# EAGLE design PMI_board (EAGLE 7.5.0)
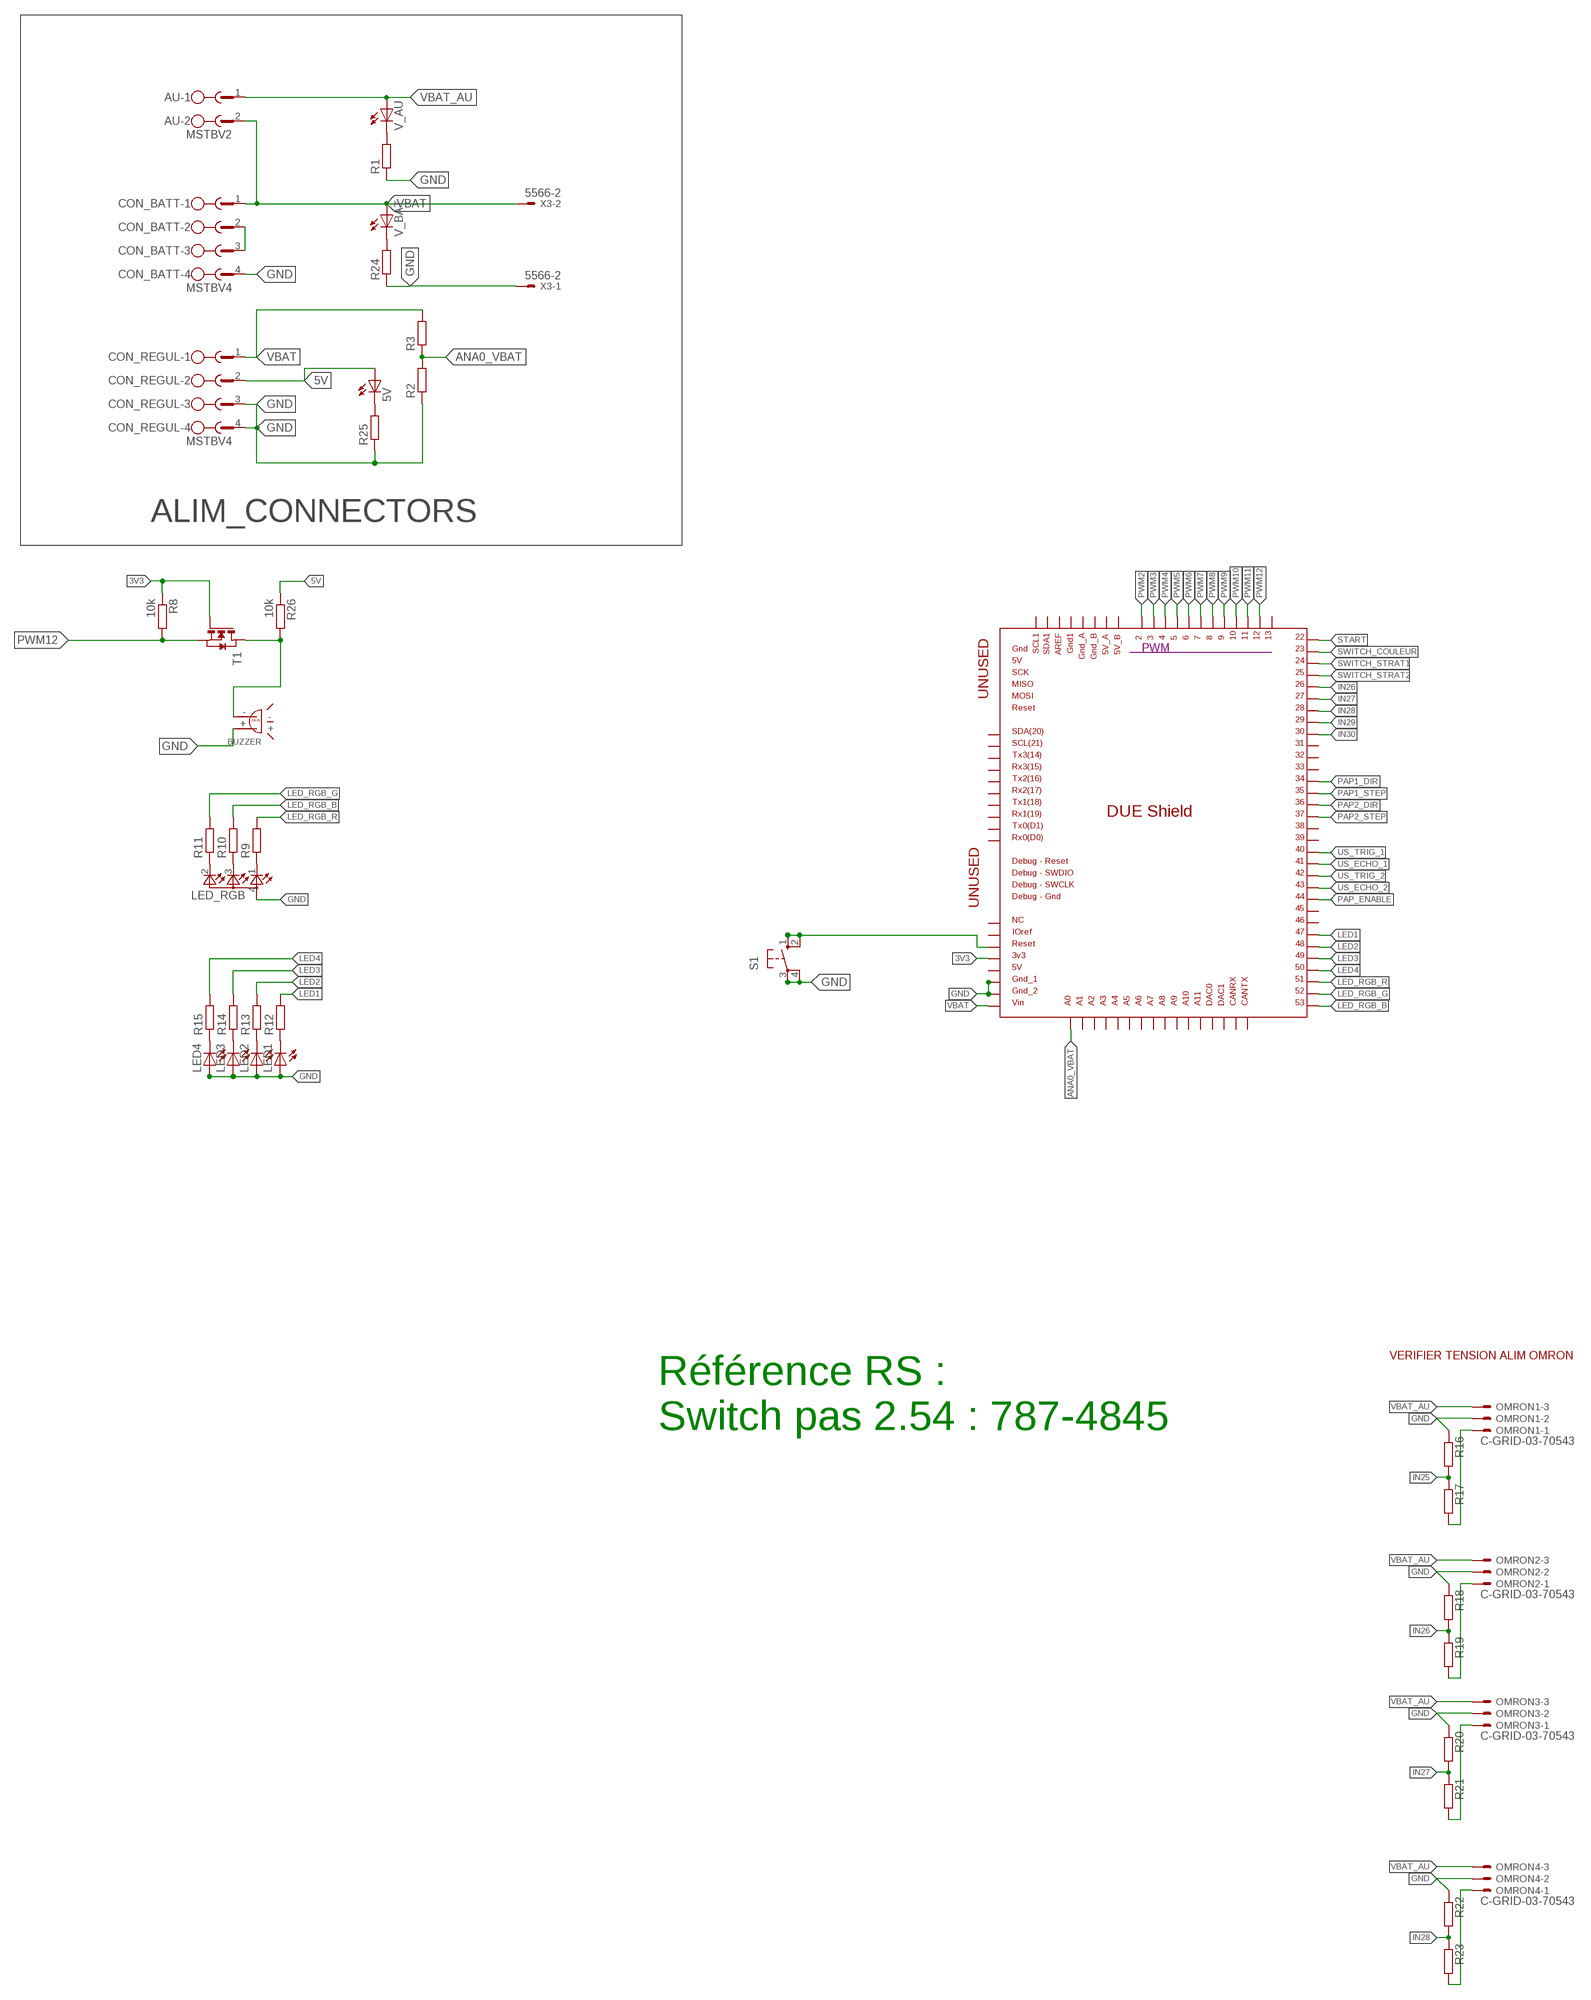
[diagram p0: schematic, sheet 1, part 1 of 2]
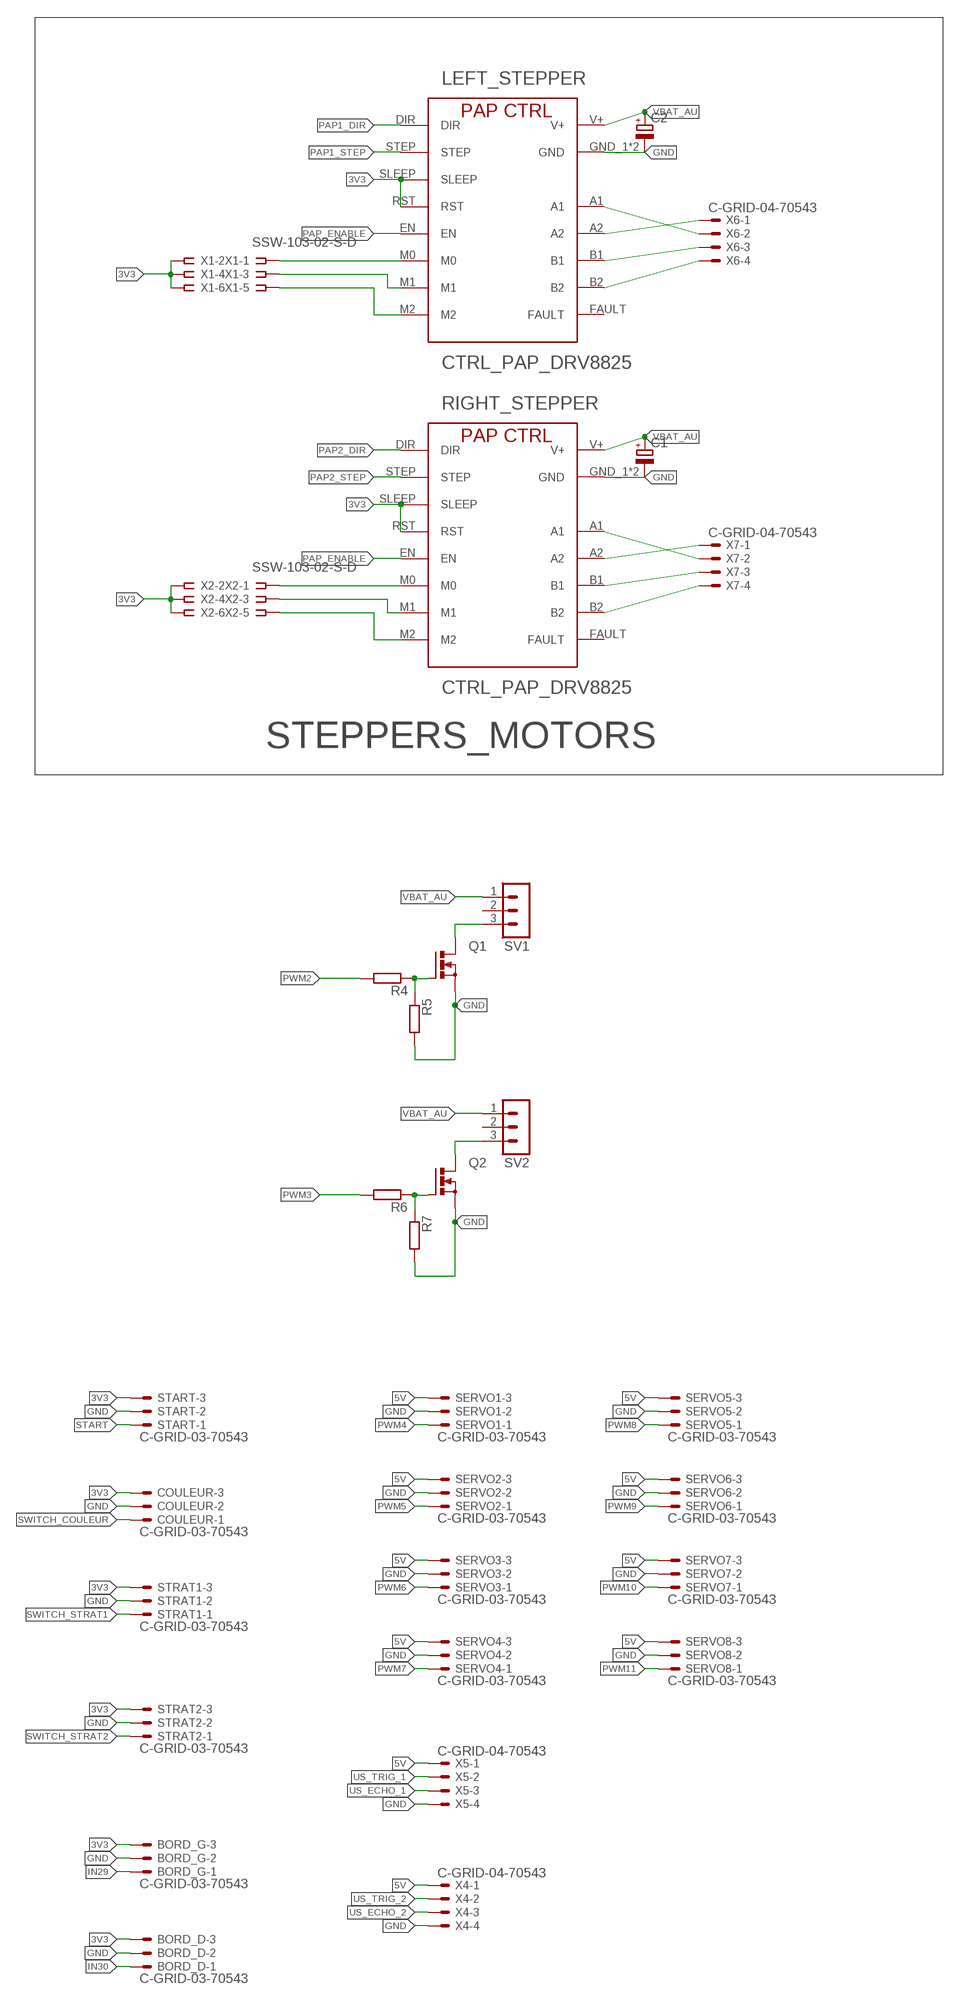
[diagram p1: schematic, sheet 1, part 2 of 2]

## Parts
5V  LED5MM  [LED5MM]
AU  MSTBV2  [MSTBV2]
BORD_D  C-GRID-03-70543  [70543-03]
BORD_G  C-GRID-03-70543  [70543-03]
BUZZER  BUZZER  [BUZZER]
C1  CPOL-EUD  [PANASONIC_D]
C2  CPOL-EUD  [PANASONIC_D]
CON_BATT  MSTBV4  [MSTBV4]
CON_REGUL  MSTBV4  [MSTBV4]
COULEUR  C-GRID-03-70543  [70543-03]
LED1  LED3MM  [LED3MM]
LED2  LED3MM  [LED3MM]
LED3  LED3MM  [LED3MM]
LED4  LED3MM  [LED3MM]
LED_RGB  TOPLED-3QPE_MAPPING  [P-LCC-4-3]
LEFT_STEPPER  CTRL_PAP_DRV8825  [CTRL_PAP]
OMRON1  C-GRID-03-70543  [70543-03]
OMRON2  C-GRID-03-70543  [70543-03]
OMRON3  C-GRID-03-70543  [70543-03]
OMRON4  C-GRID-03-70543  [70543-03]
Q1  PMOSFET_NTO220BV  [TO220BV]
Q2  PMOSFET_NTO220BV  [TO220BV]
R1  R-EU_M1206  [M1206]
R2  R-EU_M1206  [M1206]
R3  R-EU_M1206  [M1206]
R4  R-EU_M1206  [M1206]
R5  R-EU_M1206  [M1206]
R6  R-EU_M1206  [M1206]
R7  R-EU_M1206  [M1206]
R8  10k  R-EU_M1206  [M1206]
R9  R-EU_M1206  [M1206]
R10  R-EU_M1206  [M1206]
R11  R-EU_M1206  [M1206]
R12  R-EU_M1206  [M1206]
R13  R-EU_M1206  [M1206]
R14  R-EU_M1206  [M1206]
R15  R-EU_M1206  [M1206]
R16  R-EU_M1206  [M1206]
R17  R-EU_M1206  [M1206]
R18  R-EU_M1206  [M1206]
R19  R-EU_M1206  [M1206]
R20  R-EU_M1206  [M1206]
R21  R-EU_M1206  [M1206]
R22  R-EU_M1206  [M1206]
R23  R-EU_M1206  [M1206]
R24  R-EU_M1206  [M1206]
R25  R-EU_M1206  [M1206]
R26  10k  R-EU_M1206  [M1206]
RIGHT_STEPPER  CTRL_PAP_DRV8825  [CTRL_PAP]
S1  10-XX  [B3F-10XX]
SERVO1  C-GRID-03-70543  [70543-03]
SERVO2  C-GRID-03-70543  [70543-03]
SERVO3  C-GRID-03-70543  [70543-03]
SERVO4  C-GRID-03-70543  [70543-03]
SERVO5  C-GRID-03-70543  [70543-03]
SERVO6  C-GRID-03-70543  [70543-03]
SERVO7  C-GRID-03-70543  [70543-03]
SERVO8  C-GRID-03-70543  [70543-03]
START  C-GRID-03-70543  [70543-03]
STRAT1  C-GRID-03-70543  [70543-03]
STRAT2  C-GRID-03-70543  [70543-03]
SV1  MA03-1  [MA03-1]
SV2  MA03-1  [MA03-1]
T1  NMOSSOT23  [SOT-23]
U$1  DUE(NORMAL)  [DUE(NORMAL)]
V_AU  LED5MM  [LED5MM]
V_BAT  LED5MM  [LED5MM]
X1  SSW-103-02-S-D  [SSW-103-02-S-D]
X2  SSW-103-02-S-D  [SSW-103-02-S-D]
X3  5566-2  [5566-2]
X4  C-GRID-04-70543  [70543-04]
X5  C-GRID-04-70543  [70543-04]
X6  C-GRID-04-70543  [70543-04]
X7  C-GRID-04-70543  [70543-04]

## Nets
3V3: BORD_D.3 BORD_G.3 COULEUR.3 LEFT_STEPPER.RST LEFT_STEPPER.SLEEP R8.1 RIGHT_STEPPER.RST RIGHT_STEPPER.SLEEP START.3 STRAT1.3 STRAT2.3 T1.3(G) U$1.3V3 X1.2 X1.4 X1.6 X2.2 X2.4 X2.6
5V: 5V.A CON_REGUL.2 R26.1 SERVO1.3 SERVO2.3 SERVO3.3 SERVO4.3 SERVO5.3 SERVO6.3 SERVO7.3 SERVO8.3 X4.1 X5.1
A1: LEFT_STEPPER.A1 X6.2
A2: LEFT_STEPPER.A2 X6.1
ANA0_VBAT: R2.2 R3.1 U$1.A0
B1: LEFT_STEPPER.B1 X6.3
B2: LEFT_STEPPER.B2 X6.4
GND: BORD_D.2 BORD_G.2 BUZZER.+ C1.- C2.- CON_BATT.4 CON_REGUL.3 CON_REGUL.4 COULEUR.2 LED1.A LED2.A LED3.A LED4.A LED_RGB.4(A2) LEFT_STEPPER.GND_1(GND) LEFT_STEPPER.GND_2(GND) OMRON1.2 OMRON2.2 OMRON3.2 OMRON4.2 Q1.S Q2.S R1.1 R2.1 R5.2 R7.2 R16.1 R18.1 R20.1 R22.1 R24.1 R25.1 RIGHT_STEPPER.GND_1(GND) RIGHT_STEPPER.GND_2(GND) S1.3(P) S1.4(P1) SERVO1.2 SERVO2.2 SERVO3.2 SERVO4.2 SERVO5.2 SERVO6.2 SERVO7.2 SERVO8.2 START.2 STRAT1.2 STRAT2.2 U$1.GND_1 U$1.GND_2 X3.1 X4.4 X5.4
IN25: R16.2 R17.1
IN26: R18.2 R19.1 U$1.26
IN27: R20.2 R21.1 U$1.27
IN28: R22.2 R23.1 U$1.28
IN29: BORD_G.1 U$1.29
IN30: BORD_D.1 U$1.30
LED1: R12.2 U$1.47
LED2: R13.2 U$1.48
LED3: R14.2 U$1.49
LED4: R15.2 U$1.50
LED_RGB_B: R10.2 U$1.53
LED_RGB_G: R11.2 U$1.52
LED_RGB_R: R9.2 U$1.51
N$1: CON_BATT.2 CON_BATT.3
N$2: R1.2 V_AU.K(C)
N$3: LEFT_STEPPER.M0 X1.1
N$4: LEFT_STEPPER.M1 X1.3
N$5: LEFT_STEPPER.M2 X1.5
N$6: RIGHT_STEPPER.M0 X2.1
N$7: RIGHT_STEPPER.M1 X2.3
N$8: RIGHT_STEPPER.M2 X2.5
N$9: S1.1(S) S1.2(S1) U$1.RESET
N$10: Q1.G R4.1 R5.1
N$18: Q1.D SV1.3
N$19: Q2.G R6.1 R7.1
N$20: Q2.D SV2.3
N$21: BUZZER.- R26.2 T1.1(D)
N$22: OMRON1.1 R17.2
N$23: OMRON2.1 R19.2
N$24: OMRON3.1 R21.2
N$25: OMRON4.1 R23.2
N$26: RIGHT_STEPPER.A1 X7.2
N$27: RIGHT_STEPPER.A2 X7.1
N$28: RIGHT_STEPPER.B1 X7.3
N$29: RIGHT_STEPPER.B2 X7.4
N$31: LED_RGB.1(CRED) R9.1
N$32: LED_RGB.3(CBLUE) R10.1
N$33: LED_RGB.2(CGREEN) R11.1
N$34: LED1.K(C) R12.1
N$35: LED2.K(C) R13.1
N$36: LED3.K(C) R14.1
N$37: LED4.K(C) R15.1
N$44: R24.2 V_BAT.K(C)
N$45: 5V.K(C) R25.2
PAP1_DIR: LEFT_STEPPER.DIR U$1.34
PAP1_STEP: LEFT_STEPPER.STEP U$1.35
PAP2_DIR: RIGHT_STEPPER.DIR U$1.36
PAP2_STEP: RIGHT_STEPPER.STEP U$1.37
PAP_ENABLE: LEFT_STEPPER.EN RIGHT_STEPPER.EN U$1.44
PWM2: R4.2 U$1.2
PWM3: R6.2 U$1.3
PWM4: SERVO1.1 U$1.4
PWM5: SERVO2.1 U$1.5
PWM6: SERVO3.1 U$1.6
PWM7: SERVO4.1 U$1.7
PWM8: SERVO5.1 U$1.8
PWM9: SERVO6.1 U$1.9
PWM10: SERVO7.1 U$1.10
PWM11: SERVO8.1 U$1.11
PWM12: R8.2 T1.2(S) U$1.12
START: START.1 U$1.22
SWITCH_COULEUR: COULEUR.1 U$1.23
SWITCH_STRAT1: STRAT1.1 U$1.24
SWITCH_STRAT2: STRAT2.1 U$1.25
US_ECHO_1: U$1.41 X5.3
US_ECHO_2: U$1.43 X4.3
US_TRIG_1: U$1.40 X5.2
US_TRIG_2: U$1.42 X4.2
VBAT: AU.2 CON_BATT.1 CON_REGUL.1 R3.2 U$1.VIN V_BAT.A X3.2
VBAT_AU: AU.1 C1.+ C2.+ LEFT_STEPPER.V+ OMRON1.3 OMRON2.3 OMRON3.3 OMRON4.3 RIGHT_STEPPER.V+ SV1.1 SV2.1 V_AU.A
Unconnected: LEFT_STEPPER.FAULT RIGHT_STEPPER.FAULT SV1.2 SV2.2 U$1.5V U$1.5V_A U$1.5V_B U$1.13 U$1.31 U$1.32 U$1.33 U$1.38 U$1.39 U$1.45 U$1.46 U$1.A1 U$1.A2 U$1.A3 U$1.A4 U$1.A5 U$1.A6 U$1.A7 U$1.A8 U$1.A9 U$1.A10 U$1.A11 U$1.AREF U$1.CANRX U$1.CANTX U$1.DAC0 U$1.DAC1 U$1.GND1 U$1.GND_A U$1.GND_B U$1.IOREF U$1.NC U$1.RX0 U$1.RX1 U$1.RX2 U$1.RX3 U$1.SCL U$1.SCL1 U$1.SDA U$1.SDA1 U$1.TX0 U$1.TX1 U$1.TX2 U$1.TX3

## Notes on the sheet
- ALIM_CONNECTORS
- PWM
- STEPPERS_MOTORS
- VERIFIER TENSION ALIM OMRON
- Référence RS :
  Switch pas 2.54 : 787-4845

## Library data of the parts
5V LED1-LED4 V_AU V_BAT = led:LED: LED OSRAM: - CHIPLED LG R971, LG N971, LY N971, LG Q971, LY Q971, LO R971, LY R971 LH N974, LH R974 LS Q976, LO Q976, LY Q976 LO Q996 - Hyper CHIPLED LW Q18S LB Q993, LB Q99A, LB R99A - SideLED LS A670, LO A670, LY A670, LG A670, LP A670 LB A673, LV A673, LT A673, LW A673 LH A674 LY A675 LS A676, LA A676, LO A676, LY A676, LW A676 LS A679, LY A679, LG A679 - Hyper Micro SIDELED® LS Y876, LA Y876, LO Y876, LY Y876 LT Y87S - SmartLED LW L88C, LW L88S LB L89C, LB L89S, LG L890 LS L89K, LO L89K, LY L89K LS L896, LA L896, LO L896, LY L896 - TOPLED LS T670, LO T670, LY T670, LG T670, LP T670 LSG T670, LSP T670, LSY T670, LOP T670, LYG T670 LG T671, LOG T671, LSG T671 LB T673, LV T673, LT T673, LW T673 LH T674 LS T676, LA T676, LO T676, LY T676, LB T676, LH T676, LSB T676, LW T676 LB T67C, LV T67C, LT T67C, LS T67K, LO T67K, LY T67K, LW E67C LS E67B, LA E67B, LO E67B, LY E67B, LB E67C, LV E67C, LT E67C LW T67C LS T679, LY T679, LG T679 LS T770, LO T770, LY T770, LG T770, LP T770 LB T773, LV T773, LT T773, LW T773 LH T774 LS E675, LA E675, LY E675, LS T675 LS T776, LA T776, LO T776, LY T776, LB T776 LHGB T686 LT T68C, LB T68C - Hyper Mini TOPLED® LB M676 - Mini TOPLED Santana® LG M470 LS M47K, LO M47K, LY M47K Source: http://www.osram.convergy.de LUXEON: - LUMILED® LXK2-PW12-R00, LXK2-PW12-S00, LXK2-PW14-U00, LXK2-PW14-V00 LXK2-PM12-R00, LXK2-PM12-S00, LXK2-PM14-U00 LXK2-PE12-Q00, LXK2-PE12-R00, LXK2-PE12-S00, LXK2-PE14-T00, LXK2-PE14-U00 LXK2-PB12-K00, LXK2-PB12-L00, LXK2-PB12-M00, LXK2-PB14-N00, LXK2-PB14-P00, LXK2-PB14-Q00 LXK2-PR12-L00, LXK2-PR12-M00, LXK2-PR14-Q00, LXK2-PR14-R00 LXK2-PD12-Q00, LXK2-PD12-R00, LXK2-PD12-S00 LXK2-PH12-R00, LXK2-PH12-S00 LXK2-PL12-P00, LXK2-PL12-Q00, LXK2-PL12-R00 Source: www.luxeon.com KINGBRIGHT: KA-3528ASYC Source: www.kingbright.com
AU = con-phoenix-508:MSTBV2: PHOENIX; MPN: MSTBV 2,5/2-GF-5.08; OC_FARNELL: 1792792; OC_NEWARK: 69R9845
BORD_D BORD_G COULEUR OMRON1-OMRON4 SERVO1-SERVO8 START STRAT1 STRAT2 = con-molex:C-GRID-03: CONNECTOR wire to board 2.54 mm (0.100") pitch header; OC_FARNELL: unknown; OC_NEWARK: unknown
BUZZER = ARD:BUZZER
C1 C2 = rcl:CPOL-EU: POLARIZED CAPACITOR, European symbol
CON_BATT CON_REGUL = con-phoenix-508:MSTBV4: PHOENIX; MPN: MSTBV 2,5/4-GF-5.08; OC_FARNELL: 1792794; OC_NEWARK: 69R9847
LED_RGB = led:TOPLED-3: OSRAM - Hyper Multi TOPLED® (RGB) LB E673, LV E673, LT E673 - Power TOPLED® Enhanced optical Power LED (HOP2000) LS E67B, LA E67B, LO E67B, LY E67B - Hyper Multi TOPLED® Enhanced optical Power LED (HOP2000 / ATON®) LATB T66B - Hyper Multi TOPLED® Hyper-Bright LED LATB T686 Source: http://www.osram.convergy.de/
LEFT_STEPPER RIGHT_STEPPER = ARD:CTRL_PAP_DRV8825: Carte controlleur moteur pas à pas à base de DRV8825
Q1 Q2 = transistor-power:PMOSFET_N: Power MOSFET N-Channel
R1-R26 = rcl:R-EU_: RESISTOR, European symbol
S1 = switch-omron:10-XX: OMRON SWITCH; MPN: B3F-1000; OC_FARNELL: 176432; OC_NEWARK: 36M3542
SV1 SV2 = con-lstb:MA03-1: PIN HEADER; OC_FARNELL: unknown; OC_NEWARK: unknown
T1 = zetex:NMOSSOT23: MOS FET; OC_FARNELL: unknown; OC_NEWARK: unknown
U$1 = DUElib130425:DUE(NORMAL)
X1 X2 = con-samtec:SSW-103-02-S-D: THROUGH-HOLE .025" SQ POST SOCKET Source: Samtec SSW.pdf; MPN: SSW-103-02-S-D; OC_FARNELL: unknown; OC_NEWARK: 11P9365
X3 = con-molex:5566-2: Mini FIT connector 2 pol Source: http://www.molex.com; OC_FARNELL: 1822072; OC_NEWARK: unknown
X4-X7 = con-molex:C-GRID-04: CONNECTOR wire to board 2.54 mm (0.100") pitch header; OC_FARNELL: unknown; OC_NEWARK: unknown

## Board
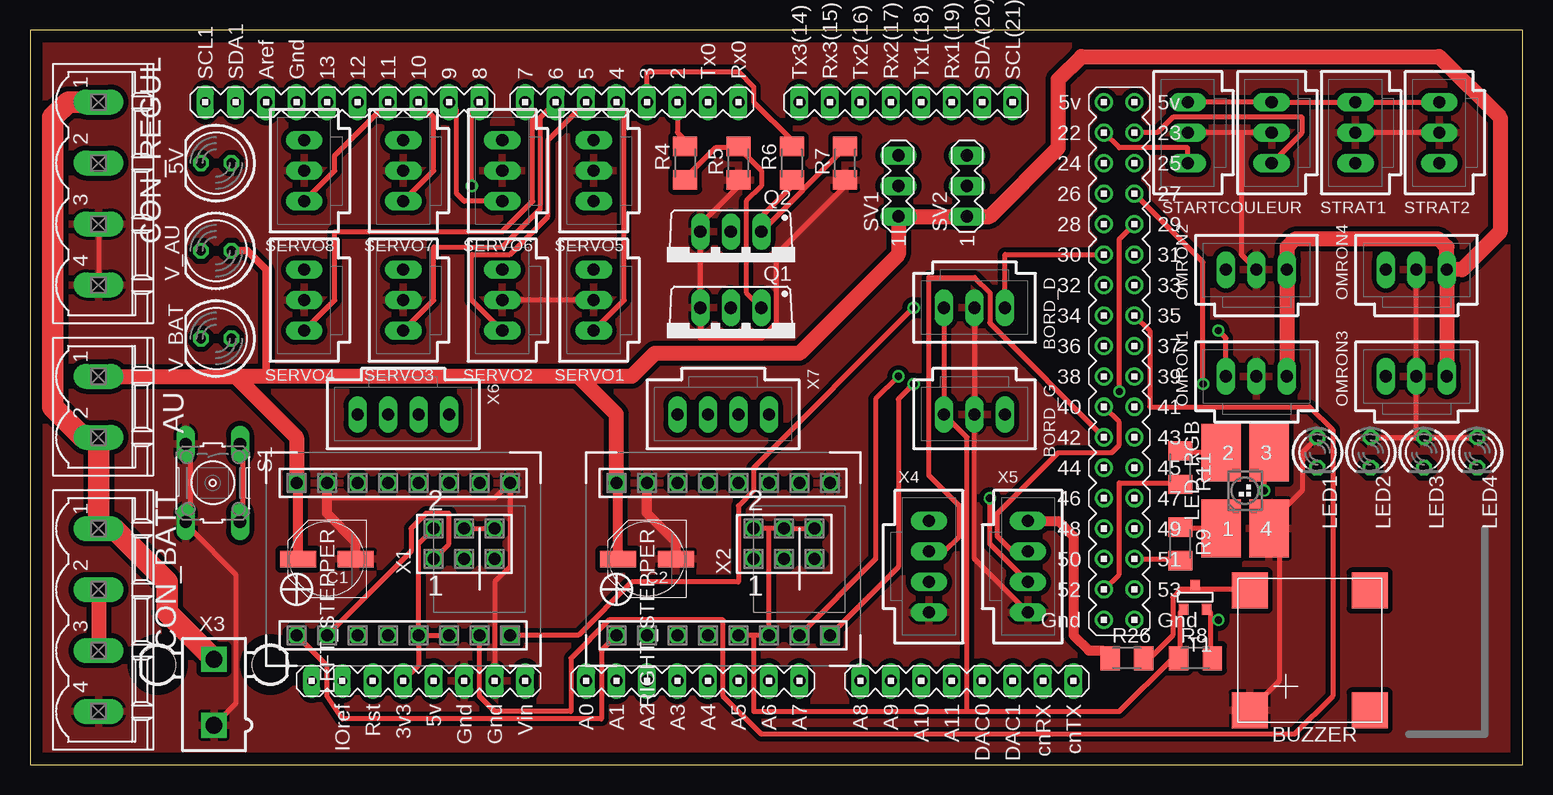
[diagram p2: board, top side]
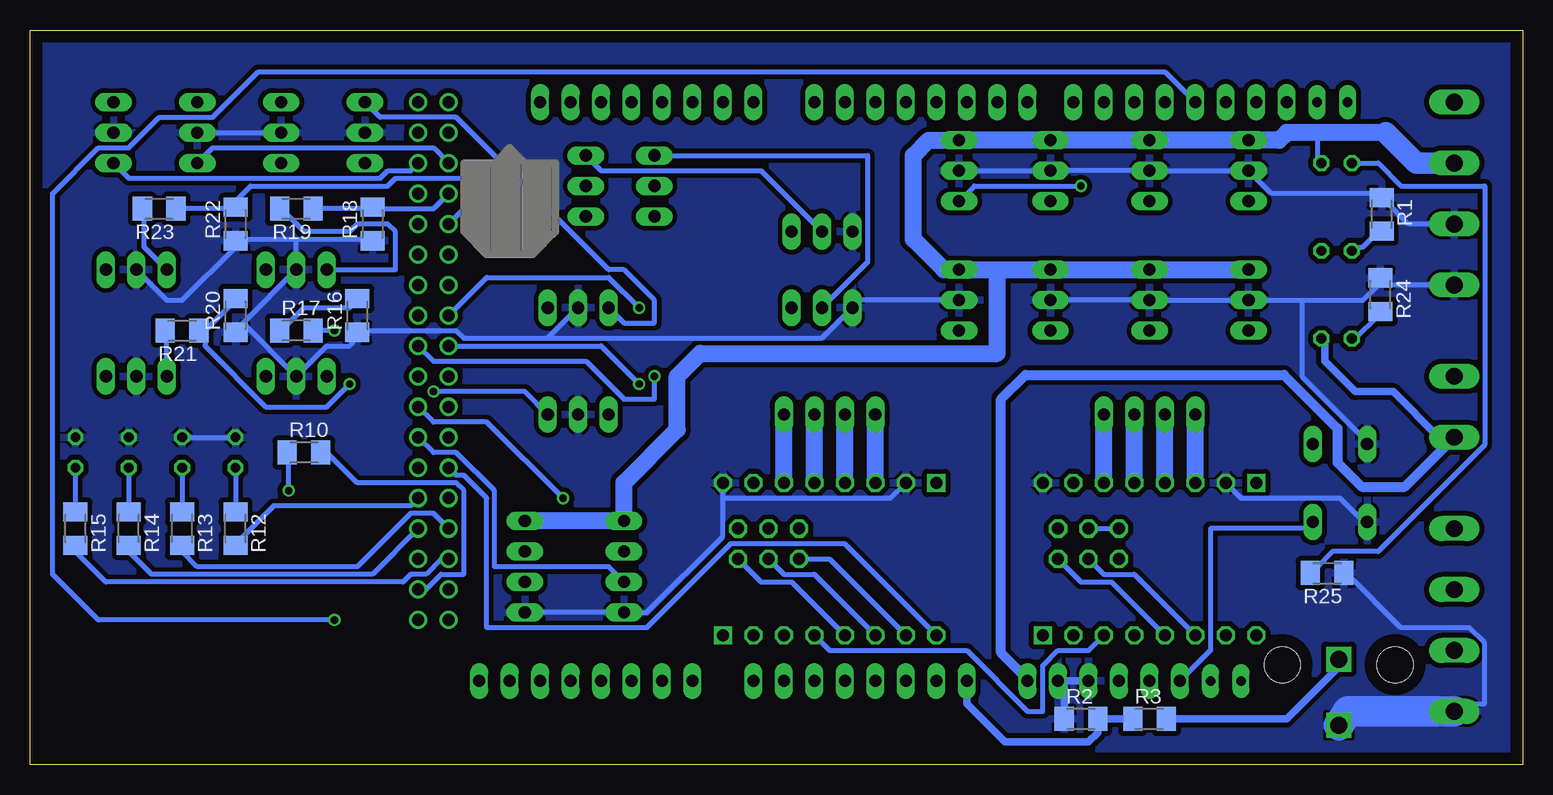
[diagram p3: board, bottom side, seen from below]

Size 124.44 x 61.27 mm. Coordinates in mm from the lower left corner, seen from the top.
Outline: 0,0 124.44,0 124.44,61.27 0,61.27 0,0
Copper layers (1*16): Top 0.035mm / dielectric 1.5mm / Bottom 0.035mm
Design rules "default *": minimum track width 16mil, minimum drill 24mil, track to track 8mil, track to pad 8mil, pad to pad 8mil, via to via 8mil, smd to smd 8mil, copper to edge 40mil, drill to drill 8mil, minimum pad ring 10mil, minimum via ring 8mil, stop-mask expansion 4mil, vias tented up to drill 0mil, thermal gap 10mil

### Footprints (pad centres in the part's own frame; a part is rotated, then mirrored left to right if it is on the bottom)
LED5MM = drill 0.813 octagon: A -1.27,0; K 1.27,0
MSTBV2 = drill 1.397 long: 1 -2.54,0; 2 2.54,0
70543-03 = drill 1.016 long: 1 -2.54,0; 2 0,0; 3 2.54,0
BUZZER = smd 3 x 3: + 5,-5; - -5,-5; UNUSED_1 -5,5; UNUSED_2 5,5
PANASONIC_D = smd 3 x 1.4: + 2.4,0; - -2.4,0
MSTBV4 = drill 1.397 long: 1 -7.62,0; 2 -2.54,0; 3 2.54,0; 4 7.62,0
LED3MM = drill 0.813 octagon: A -1.27,0; K 1.27,0
P-LCC-4-3 = smd 3.3 x 4.8: 1 -2,-3.15; 2 -2,3.15; 3 2,3.15; 4 2,-3.15
CTRL_PAP = drill 1 pad 1.5 octagon: A1 6.35,-1.27; A2 6.35,-3.81; B1 6.35,1.27; B2 6.35,3.81; EN -6.35,8.89; FAULT 6.35,-6.35; GND_1 6.35,6.35; GND_2 6.35,-8.89; M0 -6.35,6.35; M1 -6.35,3.81; M2 -6.35,1.27; RST -6.35,-1.27; SLEEP -6.35,-3.81; STEP -6.35,-6.35 | drill 1 pad 1.5 square: DIR -6.35,-8.89; V+ 6.35,8.89
TO220BV = drill 1.016 long: D 0,-2.54; G -2.54,-2.54; S 2.54,-2.54
M1206 = smd 1.6 x 2: 1 -1.4,0; 2 1.4,0
B3F-10XX = drill 1.016 long: 1 -3.251,2.261; 2 3.251,2.261; 3 -3.251,-2.261; 4 3.251,-2.261
MA03-1 = drill 1.016 long: 1 -2.54,0; 2 0,0; 3 2.54,0
SOT-23 = smd 0.787 x 0.889: 1 0.025,-1.016; 2 -0.94,1.016; 3 0.991,1.016
DUE(NORMAL) = drill 1 long: 2 -16.51,30.48; 3 -19.05,30.48; 3V3 -39.37,-17.78; 4 -21.59,30.48; 5 -24.13,30.48; 5V -36.83,-17.78; 6 -26.67,30.48; 7 -29.21,30.48; 8 -33.02,30.48; 9 -35.56,30.48; 10 -38.1,30.48; 11 -40.64,30.48; 12 -43.18,30.48; 13 -45.72,30.48; A0 -24.13,-17.78; A1 -21.59,-17.78; A2 -19.05,-17.78; A3 -16.51,-17.78; A4 -13.97,-17.78; A5 -11.43,-17.78; A6 -8.89,-17.78; A7 -6.35,-17.78; A8 -1.27,-17.78; A9 1.27,-17.78; A10 3.81,-17.78; A11 6.35,-17.78; AREF -50.8,30.48; AREF1 -50.8,30.48; CANRX 13.97,-17.78; CANTX 16.51,-17.78; DAC0 8.89,-17.78; DAC1 11.43,-17.78; GND1 -48.26,30.48; GND_1 -34.29,-17.78; GND_2 -31.75,-17.78; RESET -41.91,-17.78; RX0 -11.43,30.48; RX1 6.35,30.48; RX2 1.27,30.48; RX3 -3.81,30.48; SCL 11.43,30.48; SDA 8.89,30.48; TX0 -13.97,30.48; TX1 3.81,30.48; TX2 -1.27,30.48; TX3 -6.35,30.48; VIN -29.21,-17.78 | drill 1: 5V_A 19.05,30.48; 5V_B 21.59,30.48; 22 19.05,27.94; 23 21.59,27.94; 24 19.05,25.4; 25 21.59,25.4; 26 19.05,22.86; 27 21.59,22.86; 28 19.05,20.32; 29 21.59,20.32; 30 19.05,17.78; 31 21.59,17.78; 32 19.05,15.24; 33 21.59,15.24; 34 19.05,12.7; 35 21.59,12.7; 36 19.05,10.16; 37 21.59,10.16; 38 19.05,7.62; 39 21.59,7.62; 40 19.05,5.08; 41 21.59,5.08; 42 19.05,2.54; 43 21.59,2.54; 44 19.05,0; 45 21.59,0; 46 19.05,-2.54; 47 21.59,-2.54; 48 19.05,-5.08; 49 21.59,-5.08; 50 19.05,-7.62; 51 21.59,-7.62; 52 19.05,-10.16; 53 21.59,-10.16; GND_A 19.05,-12.7; GND_B 21.59,-12.7 | drill 0.8 pad 1.422 long: IOREF -44.45,-17.78; NC -46.99,-17.78; SCL1 -55.88,30.48; SDA1 -53.34,30.48
SSW-103-02-S-D = drill 1 pad 1.5 octagon: 1 -2.54,-1.27; 2 -2.54,1.27; 3 0,-1.27; 4 0,1.27; 5 2.54,-1.27; 6 2.54,1.27
5566-2 = drill 1.4 square: 1 0,-2.75; 2 0,2.75 | hole 3: 4.7,2.29; -4.7,2.29
70543-04 = drill 1.016 long: 1 -3.81,0; 2 -1.27,0; 3 1.27,0; 4 3.81,0

### Placement (x,y rotation side)
5V  15.52,50.16 180 top
AU  5.71,29.84 270 top
BORD_D  78.74,38.1 180 top
BORD_G  78.74,29.21 180 top
BUZZER  106.68,9.53 270 top
C1  24.77,17.14 180 top
C2  51.44,17.14 180 top
CON_BATT  5.71,12.06 270 top
CON_REGUL  5.71,47.62 270 top
COULEUR  103.5,52.7 90 top
LED1  107.31,26.04 270 top
LED2  111.76,26.04 270 top
LED3  116.2,26.04 270 top
LED4  120.65,26.04 270 top
LED_RGB  101.28,22.86 0 top
LEFT_STEPPER  31.11,17.14 90 top
OMRON1  102.23,32.38 0 top
OMRON2  102.23,41.27 0 top
OMRON3  115.57,32.38 0 top
OMRON4  115.57,41.27 0 top
Q1  58.42,35.56 180 top
Q2  58.42,41.91 180 top
R1  11.76,45.9 270 bottom
R2  36.83,3.81 0 bottom
R3  31.11,3.81 0 bottom
R4  54.61,50.16 90 top
R5  59.05,50.16 270 top
R6  63.5,50.16 90 top
R7  67.94,50.16 270 top
R8  97.16,8.89 0 top
R9  95.89,18.41 270 top
R10  101.6,26.04 0 bottom
R11  95.89,24.77 270 top
R12  107.31,19.68 270 bottom
R13  111.76,19.68 270 bottom
R14  116.2,19.68 270 bottom
R15  120.65,19.68 270 bottom
R16  97.16,37.47 90 bottom
R17  102.23,36.2 0 bottom
R18  95.89,45.09 90 bottom
R19  102.23,46.35 180 bottom
R20  107.31,37.47 90 bottom
R21  111.76,36.2 180 bottom
R22  107.31,45.09 90 bottom
R23  113.67,46.35 180 bottom
R24  11.86,39.19 270 bottom
R25  16.31,15.98 180 bottom
R26  91.44,8.89 0 top
RIGHT_STEPPER  57.78,17.14 90 top
S1  15.24,23.5 270 top
SERVO1  46.99,38.73 90 top
SERVO2  39.37,38.73 90 top
SERVO3  31.11,38.73 90 top
SERVO4  22.86,38.73 90 top
SERVO5  46.99,49.53 90 top
SERVO6  39.37,49.53 90 top
SERVO7  31.11,49.53 90 top
SERVO8  22.86,49.53 90 top
START  96.52,52.7 90 top
STRAT1  110.49,52.7 90 top
STRAT2  117.47,52.7 90 top
SV1  72.39,48.26 90 top
SV2  78.11,48.26 90 top
T1  97.16,13.97 180 top
U$1  70.48,24.77 0 top
V_AU  15.52,42.85 180 top
V_BAT  15.52,35.53 180 top
X1  36.2,18.41 0 top
X2  62.87,18.41 0 top
X3  15.34,6.05 0 top
X4  74.93,16.51 270 top
X5  83.19,16.51 270 top
X6  31.11,29.21 180 top
X7  57.78,29.21 180 top

### Tracks (layer width: path | path; a pad name or v marks a point on that pad's centre or on a via)
3V3
  Top 0.406: START.3 COULEUR.3 STRAT1.3 STRAT2.3 | X1.4 X1.6 | U$1.3V3 32.38,8.26 LEFT_STEPPER.RST | LEFT_STEPPER.RST LEFT_STEPPER.SLEEP | X1.2 32.38,18.41 LEFT_STEPPER.RST | BORD_D.3 BORD_G.3 78.11,27.3 78.11,4.45 | 61.59,19.68 X2.4 X2.6 | 61.59,19.68 X2.2 | T1.3 95.89,12.7 95.89,8.89 R8.1 95.25,8.89 90.81,4.45 78.11,4.45 | 60.33,10.79 RIGHT_STEPPER.SLEEP 61.59,19.68 | 60.33,10.79 RIGHT_STEPPER.RST | 78.11,4.45 60.33,4.45 60.33,10.79
  Bottom 0.406: X1.4 X1.2 | LEFT_STEPPER.SLEEP 36.2,9.53 38.73,9.53 40.01,8.26 40.01,4.45 41.27,4.45 46.35,9.53 57.78,9.53 RIGHT_STEPPER.RST | START.3 95.25,53.98 88.9,53.98 76.2,41.27 74.93,41.27 72.39,38.73 72.39,36.83 74.93,36.83 BORD_D.3
5V
  Top 0.813: X5.1 85.72,20.32 87,19.05 87,10.79 88.27,9.53 89.41,9.53 R26.1
  Bottom 0.406: 17.14,52.7 17.14,50.16 5V.A
  Bottom 1.422: 11.43,52.7 17.14,52.7 19.68,52.7 20.32,52.07 SERVO8.3 SERVO7.3 SERVO6.3 SERVO5.3 49.53,52.07 50.8,50.8 50.8,43.81 48.26,41.27 SERVO1.3 43.81,41.27 | 43.81,41.27 SERVO2.3 SERVO3.3 SERVO4.3 | 43.81,41.27 43.81,34.29 68.58,34.29 70.48,32.38 70.48,27.94 74.93,23.5 X4.1 X5.1
  Bottom 1.778: CON_REGUL.2 8.89,50.16 11.43,52.7
A1
  Bottom 1.422: LEFT_STEPPER.A1 X6.2
A2
  Bottom 1.422: LEFT_STEPPER.A2 X6.1
ANA0_VBAT
  Bottom 0.61: R3.1 R2.2 35.43,2.67 36.2,1.91 43.18,1.91 46.35,5.08 U$1.A0
B1
  Bottom 1.422: LEFT_STEPPER.B1 X6.3
B2
  Bottom 1.422: LEFT_STEPPER.B2 X6.4
GND
  Top 0.406: S1.3 13.34,26.67 13.34,20.32 S1.4 13.34,19.68 17.14,15.88 17.14,5.08 15.88,3.81 X3.1 | 24.77,22.23 38.73,22.23 LEFT_STEPPER.GND_2 40.01,16.51 38.73,15.24 U$1.GND_2 | R5.2 59.05,48.26 55.88,45.09 Q2.S Q1.S 55.88,35.56 60.96,35.56 62.23,36.83 62.23,42.55 67.94,48.26 R7.2 | CON_REGUL.3 CON_REGUL.4 | SERVO1.2 SERVO2.2 | BORD_D.2 BORD_G.2 78.74,17.14 X5.4 | COULEUR.2 100.97,52.7 | 100.97,52.7 START.2 | STRAT2.2 STRAT1.2 | OMRON2.2 100.97,42.55 100.97,52.7 | BUZZER.+ 104.14,6.99 104.14,19.05 103.5,19.68 LED_RGB.4 103.5,20.32 106.05,22.86 106.05,26.04 LED1.A | LED2.A 115.57,27.3 | LED4.A LED3.A 115.57,27.3 | 115.57,27.3 OMRON3.2 OMRON4.2
  Top 0.813: C2.- 53.84,18.55 51.44,20.95 RIGHT_STEPPER.GND_1 | C1.- 27.16,18.55 24.77,20.95 24.77,22.23 LEFT_STEPPER.GND_1
  Bottom 0.406: R25.1 14.61,15.88 10.16,11.43 4.45,11.43 3.17,10.16 3.17,5.08 5.08,5.08 CON_BATT.4 | LEFT_STEPPER.GND_1 23.5,22.23 15.24,22.23 13.34,20.32 S1.4 | SERVO5.2 SERVO6.2 SERVO7.2 SERVO8.2 20.95,47.62 12.06,47.62 R1.1 11.43,46.99 9.53,45.09 CON_REGUL.3 | CON_REGUL.4 11.43,40.01 R24.1 12.06,40.01 13.34,38.73 18.41,38.73 | SERVO2.2 SERVO3.2 SERVO4.2 18.41,38.73 | SERVO1.2 55.24,38.73 Q1.S 58.42,35.56 81.28,35.56 | 18.41,38.73 18.41,32.38 13.34,27.3 S1.3 | 66.67,22.23 66.67,19.05 73.03,12.7 X4.4 X5.4 | 66.67,22.23 RIGHT_STEPPER.GND_2 | RIGHT_STEPPER.GND_1 52.7,22.23 66.67,22.23 | 102.23,43.81 107.31,43.81 R22.1 107.31,43.18 111.76,38.73 113.03,38.73 OMRON4.2 | 102.23,43.81 95.89,43.81 R18.1 | 106.68,36.83 OMRON2.2 102.23,43.81 | 106.68,36.83 107.31,36.2 R20.1 106.68,36.83 | 106.68,36.83 OMRON1.2 99.69,34.92 97.79,34.92 97.16,35.56 R16.1 97.16,36.2 88.9,36.2 88.27,35.56 81.28,35.56 | STRAT1.2 COULEUR.2 | LED2.A LED1.A | 81.28,35.56 BORD_D.2
  Bottom 0.61: R2.1 38.23,6.48 U$1.GND_2 U$1.GND_1
  Bottom 2.54: CON_BATT.4 14.59,4.45 X3.1
  pour Bottom (isolate 0.406): 0.64,0.64 0.64,60.33 123.83,60.33 123.83,0.64
  pour Top (isolate 0.406): 0.64,0.64 0.64,60.33 123.83,60.33 123.83,0.64
IN25
  Bottom 0.406: R16.2 97.16,38.73 97.79,38.1 101.6,38.1 103.5,36.2 R17.1
IN26
  Bottom 0.406: 95.89,46.35 R19.1 | U$1.26 90.81,46.35 95.89,46.35 | 95.89,46.35 R18.2
IN27  (via drill 0.61)
  Top 0.406: U$1.27 97.79,41.91 v97.79,31.75
  Bottom 0.406: 109.86,36.2 107.31,38.73 R20.2 | v97.79,31.75 99.69,29.84 104.78,29.84 109.86,34.92 109.86,36.2 | 109.86,36.2 R21.1
IN28
  Bottom 0.406: R23.1 107.31,46.35 R22.2 107.31,46.99 106.05,48.26 94.61,48.26 93.98,48.9 88.27,48.9 88.27,46.35 U$1.28
IN29  (via drill 0.61)
  Top 0.406: U$1.29 90.81,43.81 v90.81,31.11
  Bottom 0.406: v90.81,31.11 83.19,31.11 BORD_G.1
IN30
  Top 0.406: U$1.30 81.28,42.55 BORD_D.1
LED1
  Bottom 0.406: U$1.47 92.71,21.59 104.14,21.59 107.31,18.41 R12.2
LED2
  Bottom 0.406: U$1.48 90.81,20.95 92.71,20.95 97.16,16.51 110.49,16.51 111.76,17.78 R13.2
LED3
  Bottom 0.406: U$1.49 95.89,15.88 114.3,15.88 116.2,17.78 R14.2
LED4
  Bottom 0.406: U$1.50 90.17,17.14 91.44,15.88 92.71,15.88 93.34,15.24 118.11,15.24 120.65,17.78 R15.2
LED_RGB_B
  Bottom 0.406: U$1.53 91.44,14.61 90.17,15.88 88.27,15.88 88.27,22.86 88.9,23.5 97.16,23.5 99.69,26.04 R10.2
LED_RGB_G
  Top 0.406: U$1.52 90.81,15.88 90.81,23.5 95.89,23.5 R11.2
LED_RGB_R
  Top 0.406: U$1.51 95.89,17.14 R9.2
N$1
  Top 1.27: CON_BATT.2 CON_BATT.3
N$2
  Bottom 0.406: R1.2 12.06,44.45 13.34,43.18 13.97,43.18 V_AU.K
N$3
  Top 0.406: LEFT_STEPPER.M0 31.75,17.78 31.75,19.68 33.02,20.95 34.92,20.95 34.92,18.41 X1.1
N$4
  Bottom 0.406: LEFT_STEPPER.M1 32.38,15.88 34.92,15.88 X1.3
N$5
  Bottom 0.406: LEFT_STEPPER.M2 34.29,15.24 36.83,15.24 X1.5
N$6
  Bottom 0.406: RIGHT_STEPPER.M0 57.78,17.14 X2.1
N$7
  Bottom 0.406: RIGHT_STEPPER.M1 59.05,15.88 61.59,15.88 X2.3
N$8
  Bottom 0.406: RIGHT_STEPPER.M2 60.96,15.24 63.5,15.24 X2.5
N$9
  Top 0.406: S1.1 17.78,26.67 17.78,20.32 S1.2
  Bottom 0.406: U$1.RESET 26.04,9.53 26.04,19.68 17.78,19.68 S1.2
N$10
  Top 0.406: 59.05,51.44 57.15,51.44 54.61,48.9 R4.1 | Q1.G 59.69,39.37 59.69,46.99 60.96,48.26 60.96,49.53 59.05,51.44 | 59.05,51.44 R5.1
N$18
  Bottom 0.406: Q1.D 54.61,41.91 54.61,50.8 SV1.3
N$19
  Top 0.406: R6.1 63.5,48.26 60.96,45.72 Q2.G 67.94,51.44 R7.1
N$20
  Bottom 0.406: Q2.D 63.5,49.53 76.83,49.53 SV2.3
N$21
  Top 0.406: 97.16,14.61 101.6,14.61 BUZZER.- | 97.16,14.61 95.89,14.61 95.25,13.97 95.25,10.79 93.34,8.89 R26.2 | 97.16,14.61 T1.1
N$22  (via drill 0.61)
  Top 0.406: v99.06,36.2 99.69,35.56 OMRON1.1
  Bottom 0.406: v99.06,36.2 R17.2
N$23
  Bottom 0.406: OMRON2.1 93.98,41.27 93.98,44.45 94.61,45.09 97.16,45.09 97.79,44.45 101.6,44.45 103.5,46.35 R19.2
N$24
  Bottom 0.406: OMRON3.1 113.03,36.2 R21.2
N$25
  Bottom 0.406: OMRON4.1 114.94,43.18 114.94,46.35 R23.2
N$26
  Bottom 1.422: RIGHT_STEPPER.A1 X7.2
N$27
  Bottom 1.422: RIGHT_STEPPER.A2 X7.1
N$28
  Bottom 1.422: RIGHT_STEPPER.B1 X7.3
N$29
  Bottom 1.422: RIGHT_STEPPER.B2 X7.4
N$31
  Top 0.406: R9.1 95.89,19.68 99.06,19.68 LED_RGB.1
N$32  (via drill 0.61)
  Top 0.406: v102.87,22.86 102.87,25.4 LED_RGB.3
  Bottom 0.406: v102.87,22.86 102.87,26.04 R10.1
N$33
  Top 0.406: R11.1 95.89,26.04 99.06,26.04 LED_RGB.2
N$34
  Bottom 0.406: LED1.K R12.1
N$35
  Bottom 0.406: LED2.K R13.1
N$36
  Bottom 0.406: LED3.K R14.1
N$37
  Bottom 0.406: LED4.K R15.1
N$44
  Bottom 0.406: R24.2 12.06,37.47 13.97,35.56 V_BAT.K
N$45
  Bottom 0.406: 5V.K 12.06,50.16 10.16,48.26 3.17,48.26 3.17,26.67 12.06,17.78 15.88,17.78 17.14,16.51 R25.2
PAP1_DIR  (via drill 0.61)
  Top 0.406: LEFT_STEPPER.DIR 45.72,10.79 50.16,15.24 59.05,15.24 59.05,21.59 60.33,22.86 60.33,24.77 v73.66,38.1
  Bottom 0.406: v73.66,38.1 76.2,40.64 86.36,40.64 U$1.34
PAP1_STEP
  Top 0.406: LEFT_STEPPER.STEP 37.47,5.71 38.73,4.45 45.09,4.45 45.09,8.89 48.26,12.06 57.78,12.06 57.78,5.71 60.96,2.54 105.41,2.54 108.58,5.71 108.58,27.94 106.68,29.84 93.34,29.84 93.34,36.2 U$1.35
PAP2_DIR  (via drill 0.61)
  Top 0.406: RIGHT_STEPPER.DIR 72.39,16.51 72.39,30.48 v73.66,31.75
  Bottom 0.406: v73.66,31.75 76.83,34.92 U$1.36
PAP2_STEP  (via drill 0.61)
  Top 0.406: RIGHT_STEPPER.STEP 70.48,17.14 70.48,30.48 v72.39,32.38
  Bottom 0.406: v72.39,32.38 72.39,30.48 74.93,30.48 78.11,33.66 90.81,33.66 U$1.37
PAP_ENABLE
  Top 0.406: LEFT_STEPPER.EN 24.77,8.26 24.77,5.71 26.04,3.81 47.62,3.81 47.62,9.53 RIGHT_STEPPER.EN
  Bottom 0.406: U$1.44 88.9,24.13 88.27,24.13 86.36,22.23 86.36,11.43 73.03,11.43 66.04,18.41 56.52,18.41 RIGHT_STEPPER.EN
PWM2
  Top 0.406: U$1.2 53.98,52.7 54.61,52.07 R4.2
PWM3
  Top 0.406: U$1.3 51.44,57.78 59.05,57.78 60.33,56.52 60.33,55.24 63.5,52.07 R6.2
PWM4
  Top 0.406: U$1.4 49.53,54.61 49.53,38.73 SERVO1.1
PWM5
  Top 0.406: U$1.5 43.18,52.07 43.18,45.72 40.01,42.55 36.83,42.55 36.83,38.73 SERVO2.1
PWM6
  Top 0.406: U$1.6 42.55,53.98 42.55,46.35 39.37,43.18 33.66,43.18 33.66,38.73 SERVO3.1
PWM7
  Top 0.406: U$1.7 41.91,54.61 41.91,46.99 39.37,44.45 25.4,44.45 25.4,38.73 SERVO4.1
PWM8  (via drill 0.61)
  Top 0.406: U$1.8 36.83,54.61 v36.83,48.26
  Bottom 0.406: v36.83,48.26 45.72,48.26 SERVO5.1
PWM9
  Top 0.406: U$1.9 35.56,54.61 35.56,47.62 36.2,46.99 SERVO6.1
PWM10
  Top 0.406: U$1.10 33.66,53.98 33.66,49.53 SERVO7.1
PWM11
  Top 0.406: U$1.11 25.4,50.8 25.4,49.53 SERVO8.1
PWM12  (via drill 0.61)
  Top 0.406: 98.42,12.06 98.42,8.89 R8.2 | 98.42,12.06 98.42,12.7 T1.2 | 98.42,12.06 v99.06,12.06
  Bottom 0.406: U$1.12 29.84,57.78 105.41,57.78 109.22,53.98 113.67,53.98 116.2,51.44 118.75,51.44 122.56,47.62 122.56,15.88 118.75,12.06 v99.06,12.06
START
  Top 0.406: U$1.22 90.81,51.44 96.52,51.44 START.1
SWITCH_COULEUR
  Top 0.406: U$1.23 93.98,52.7 95.25,53.98 106.05,53.98 106.05,52.7 COULEUR.1
SWITCH_STRAT1
  Bottom 0.406: U$1.24 90.81,51.44 109.22,51.44 STRAT1.1
SWITCH_STRAT2
  Bottom 0.406: U$1.25 92.71,49.53 94.61,49.53 95.25,48.9 116.2,48.9 STRAT2.1
US_ECHO_1  (via drill 0.61)
  Top 0.406: v80.01,22.23 80.01,18.41 X5.3
  Bottom 0.406: U$1.41 90.81,28.57 86.36,28.57 v80.01,22.23
US_ECHO_2
  Bottom 0.406: U$1.43 90.81,26.04 88.9,26.04 85.72,22.86 85.72,16.51 76.2,16.51 X4.3
US_TRIG_1
  Top 0.406: U$1.40 90.81,28.57 90.81,26.67 90.17,26.04 85.72,26.04 80.64,20.95 80.64,19.05 81.92,17.78 X5.2
US_TRIG_2
  Top 0.406: U$1.42 80.01,36.83 80.01,39.37 78.74,40.64 74.93,40.64 74.93,24.13 77.47,21.59 77.47,19.05 76.2,17.78 X4.2
VBAT
  Top 1.778: CON_REGUL.1 3.17,55.24 1.91,53.98 1.91,29.84 4.45,27.3 AU.2 CON_BATT.1 6.99,19.68 11.43,15.24 11.43,13.97 11.44,12.7 X3.2
  Bottom 0.61: AU.2 6.99,27.3 10.79,31.11 13.97,31.11 16.51,33.66 16.51,35.26 V_BAT.A | R3.2 19.68,3.81 15.24,8.26 X3.2
  Bottom 0.813: U$1.VIN 41.27,7.14 43.48,9.35 43.48,30.48 41.45,32.51 19.91,32.51 15.44,28.04 15.44,25.2 13.41,23.16 9.86,23.16 AU.2
VBAT_AU
  Top 0.61: V_AU.A 18.11,42.85 19.68,41.27 19.68,32.38
  Top 0.813: C2.+ 49.03,23.36 RIGHT_STEPPER.V+ | C1.+ 22.36,23.36 LEFT_STEPPER.V+
  Top 1.27: AU.1 17.14,32.38 | 17.14,32.38 22.23,27.3 LEFT_STEPPER.V+ | RIGHT_STEPPER.V+ 48.9,29.21 45.72,32.38 | 45.72,32.38 19.68,32.38 17.14,32.38 | 45.72,32.38 50.16,32.38 52.07,34.29 64.14,34.29 72.39,42.55 SV1.1 SV2.1 80.01,45.72 85.72,51.44 85.72,57.15 87.63,59.05 117.47,59.05 122.56,53.98 122.56,44.45 119.38,41.27 OMRON4.3 | OMRON4.3 OMRON3.3 | OMRON4.3 118.11,43.18 117.47,43.81 105.41,43.81 104.78,43.18 OMRON2.3 OMRON1.3

### Text on the board
tDocu: OIGNONS INTERDITS | 8==> | PMI BOARD / 03/04/16 V1
bDocu: Quentin E est en colère parcequ'il a finit à 4h vendredi | Bouclier / anti-CEM | 8==> | Tanguy était (encore!) à un concert hier